# Altium project serial-con.PrjPCB
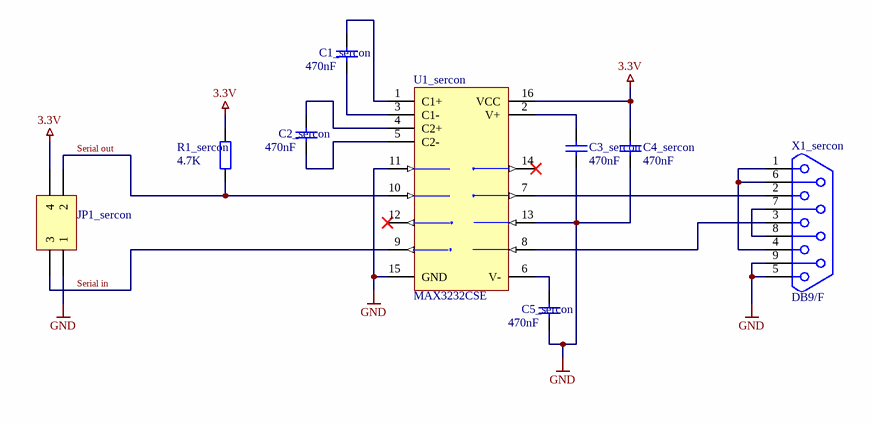
[diagram p0: serial-con.SchDoc]
1 sheet, 10 parts. Net scope: global (net labels, ports and power ports of the same name join across sheets).
Board file: serial-con.PcbDoc

## Sheet serial-con.SchDoc: Serial Adapter
size A4; Organization: Berne University of Applied Science; Address1: School of Engineering and; Address2: Information Technology; Address3: Quellgasse 21; Address4: CH-2501 Biel; Revision: 1.0; SheetNumber: 19; SheetTotal: 19; Author: zac1; PageSetup: Record=PageOptions|CenterHorizontal=True|CenterVertical=True|PrintScale=1.00|XCorrection=1.00|YCorrection=1.00|PrintKind=0|BorderSize=5000000|LeftOffset=0|BottomOffset=0|Orientation=2|PaperLength=1000|PaperWidth=1000|Scale=100|PaperSource=7|PrintQuality=-4|MediaType=1|DitherType=10|PaperKind=A4|PrintScaleMode=1

### Parts
1_sercon  CC License  [CC-License]  (value not drawn)
C1_sercon  value 470nF  [0603]  (hidden comment: Cap)
C2_sercon  value 470nF  [0603]  (hidden comment: Cap)
C3_sercon  value 470nF  [0603]  (hidden comment: Cap)
C4_sercon  value 470nF  [0603]  (hidden comment: Cap)
C5_sercon  value 470nF  [0603]  (hidden comment: Cap)
JP1_sercon  M22-2040205  [M22-2040205]  (value not drawn)
R1_sercon  value 4.7K  [0402]  (hidden comment: Res2)
U1_sercon  MAX3232CSE  [SO-G16]
X1_sercon  DB9/F  [DSUB9RA/F]

### Nets
3.3V: C4_sercon.2 JP1_sercon.4 R1_sercon.2 U1_sercon.16(VCC)
GND: C3_sercon.1 C4_sercon.1 C5_sercon.1 JP1_sercon.1 U1_sercon.11(T1IN) U1_sercon.13(R1IN) U1_sercon.15(GND) X1_sercon.5 X1_sercon.9
Serial in: JP1_sercon.3 U1_sercon.9(R2OUT)
Serial out: JP1_sercon.2 R1_sercon.1 U1_sercon.10(T2IN)
NetC1_sercon_1: C1_sercon.1 U1_sercon.3(C1-)
NetC1_sercon_2: C1_sercon.2 U1_sercon.1(C1+)
NetC2_sercon_1: C2_sercon.1 U1_sercon.5(C2-)
NetC2_sercon_2: C2_sercon.2 U1_sercon.4(C2+)
NetC3_sercon_2: C3_sercon.2 U1_sercon.2(V+)
NetC5_sercon_2: C5_sercon.2 U1_sercon.6(V-)
NetU1_sercon_7: U1_sercon.7(T2OUT) X1_sercon.2
NetU1_sercon_8: U1_sercon.8(R2IN) X1_sercon.3
NetX1_sercon_1: X1_sercon.1 X1_sercon.4 X1_sercon.6
NetX1_sercon_7: X1_sercon.7 X1_sercon.8

Not connected (* = marked no-connect by the designer): U1_sercon 12(R1OUT)* 14(T1OUT)*

### Notes on the sheet
- Title:
- Size:
- Date:
- A4_L
- Author:
- Time:
- Revision:
- Sheet
- of
- File:

### Library data of the parts
C1_sercon C2_sercon C3_sercon C4_sercon C5_sercon = Cap: Capacitor; Manufacturer: PHYCOMP; Part Number: 2238 786 19758; Class I: Passive; Currency: CHF; Packaging unit: 10; Published: 8-Jun-2000; Revision: July-2002: Re-released for DXP Platform.; Publisher: Altium Limited; Class II: Capacitor; Distributor: Farnell; Distributor Number: 3188 851; RoHS: yes; Price: 0.17
JP1_sercon = M22-2040205: Manufacturer: HARWIN; Currency: CHF; Packaging unit: 1; VALUE: M22-2040205; Distributor: Farnell; Part Number: M22-2040205; RoHS: yes; Distributor Number: 672 208; Price: 1.2
R1_sercon = Res2: Resistor; Manufacturer: PHYCOMP; Part Number: 232270674702; Class I: Passive; Currency: CHF; Packaging unit: 50; Published: 8-Jun-2000; Revision: July-2002: Re-released for DXP Platform.; Publisher: Altium Limited; Class II: Resistor; Distributor: Farnell; Distributor Number: 9239 316; RoHS: yes; Price: 0.12
U1_sercon = MAX3232CSE: 3.0V TO 5.5V, Low-Power, up to 1Mbps, True RS-232 Transceiver Using Four 0.1µF External Capacitor; Manufacturer: Maxim; Class I: Communication; Currency: CHF; Packaging unit: 1; Published: 16-Jan-2001; Revision: July-2002: Re-released for DXP Platform.; Datasheet: Latest Revision: Mar-1999; Package Reference: NSO16; Publisher: Altium Limited; Class II: Transceiver; Value: MAX3232CSE; Distributor: Distrelec; Distributor Number: 648 973; Part Number: MAX 3232 CSE; RoHS: yes; Price: 7.75
X1_sercon = DB9/F: Manufacturer: MULTICOMP; Part Number: 5504F1-09S-01-03-F1; Value: DB9F; Currency: CHF; Packaging unit: 10; Distributor: Farnell; Distributor Number: 1084 710; RoHS: yes; Price: 1.55